# Altium schematic sheet 参考电路.SchDoc
size 292 x 193 mm; Author: Power Lin; SheetNumber: 1; SheetTotal: 1; Website: wiki-power.com
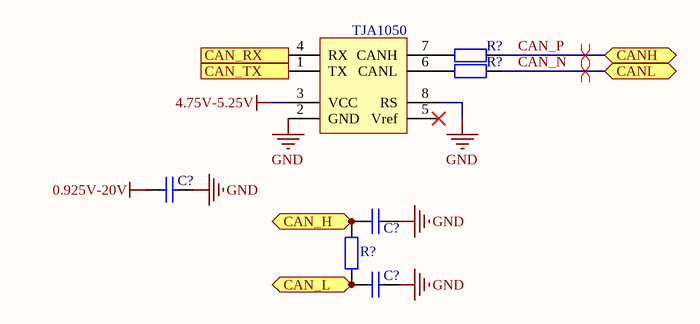
[diagram p0: 参考电路.SchDoc]

## Parts
(Parts that share a designator on the sheet are numbered #1, #2 ... from top to bottom, then left to right.)
C?#1  100nF  [CAP-0603]  (value not drawn)
C?#2  30pF  [CAP-0603]  (value not drawn)
C?#3  30pF  [CAP-0603]  (value not drawn)
R?#1  0R  [R-0603]  (value not drawn)
R?#2  0R  [R-0603]  (value not drawn)
R?#3  120R  [R-0603]  (value not drawn)
U?  TJA1050  [SOIC_8]

## Ports
CAN_H (bidir), CAN_L (bidir), CAN_RX (in), CAN_TX (out), CANH (bidir), CANL (bidir)

## Nets
0.925V-20V: C?#1.1
4.75V-5.25V: U?.3(VCC)
GND: C?#1.2 C?#2.2 C?#3.2 U?.2(GND) U?.8(RS)
CAN_H: C?#2.1 R?#3.2 ; port CAN_H
CAN_L: C?#3.1 R?#3.1 ; port CAN_L
CAN_N: R?#2.2 ; port CANL
CAN_P: R?#1.2 ; port CANH
CAN_RX: U?.4(RX) ; port CAN_RX
CAN_TX: U?.1(TX) ; port CAN_TX
NetR?#1_1: R?#1.1 U?.7(CANH)
NetR?#2_1: R?#2.1 U?.6(CANL)

Not connected (* = marked no-connect by the designer): U? 5(Vref)*

## Layout directives
differential pair: CAN_N, CAN_P

## Notes on the sheet
- Author
- DocumentName
- ModifiedDate
- ProjectName
- SheetNumber
- SheetTotal
- Website
- Revision

## Library data of the parts
C?#1-C?#3 = CAP: 贴片电容; ComponentLink1Description: 供应商链接; ComponentLink1URL: http://www.szlcsc.com/product/details_53938.html; Package: 0402; Supplier: LC; SuppliersPartNumber: C52923
R?#1-R?#3 = RES: 贴片电阻; Package: 0805; Supplier: LC; SuppliersPartNumber: C17798
U? = TJA1050: CAN 控制器（5V）